# Altium schematic sheet QCopterMV_SWD_Sch.SchDoc
size A4
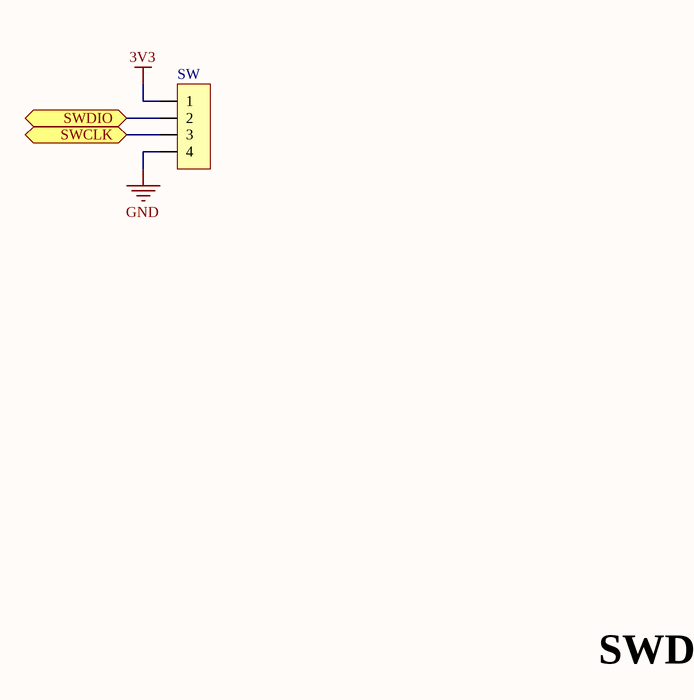
[diagram p0: QCopterMV_SWD_Sch.SchDoc]

## Parts
SW  HDR1X4_90F_2.54  [HDR1X4_90F_2.54]  (value not drawn)

## Ports
SWCLK, SWDIO

## Nets
3V3: SW.1
GND: SW.4
SWCLK: SW.3 ; port SWCLK
SWDIO: SW.2 ; port SWDIO

## Notes on the sheet
- SWD

## Library data of the parts
SW = HDR1X4_90F_2.54: Header